# EAGLE schematic Electrical Connections (EAGLE 9.6.2)
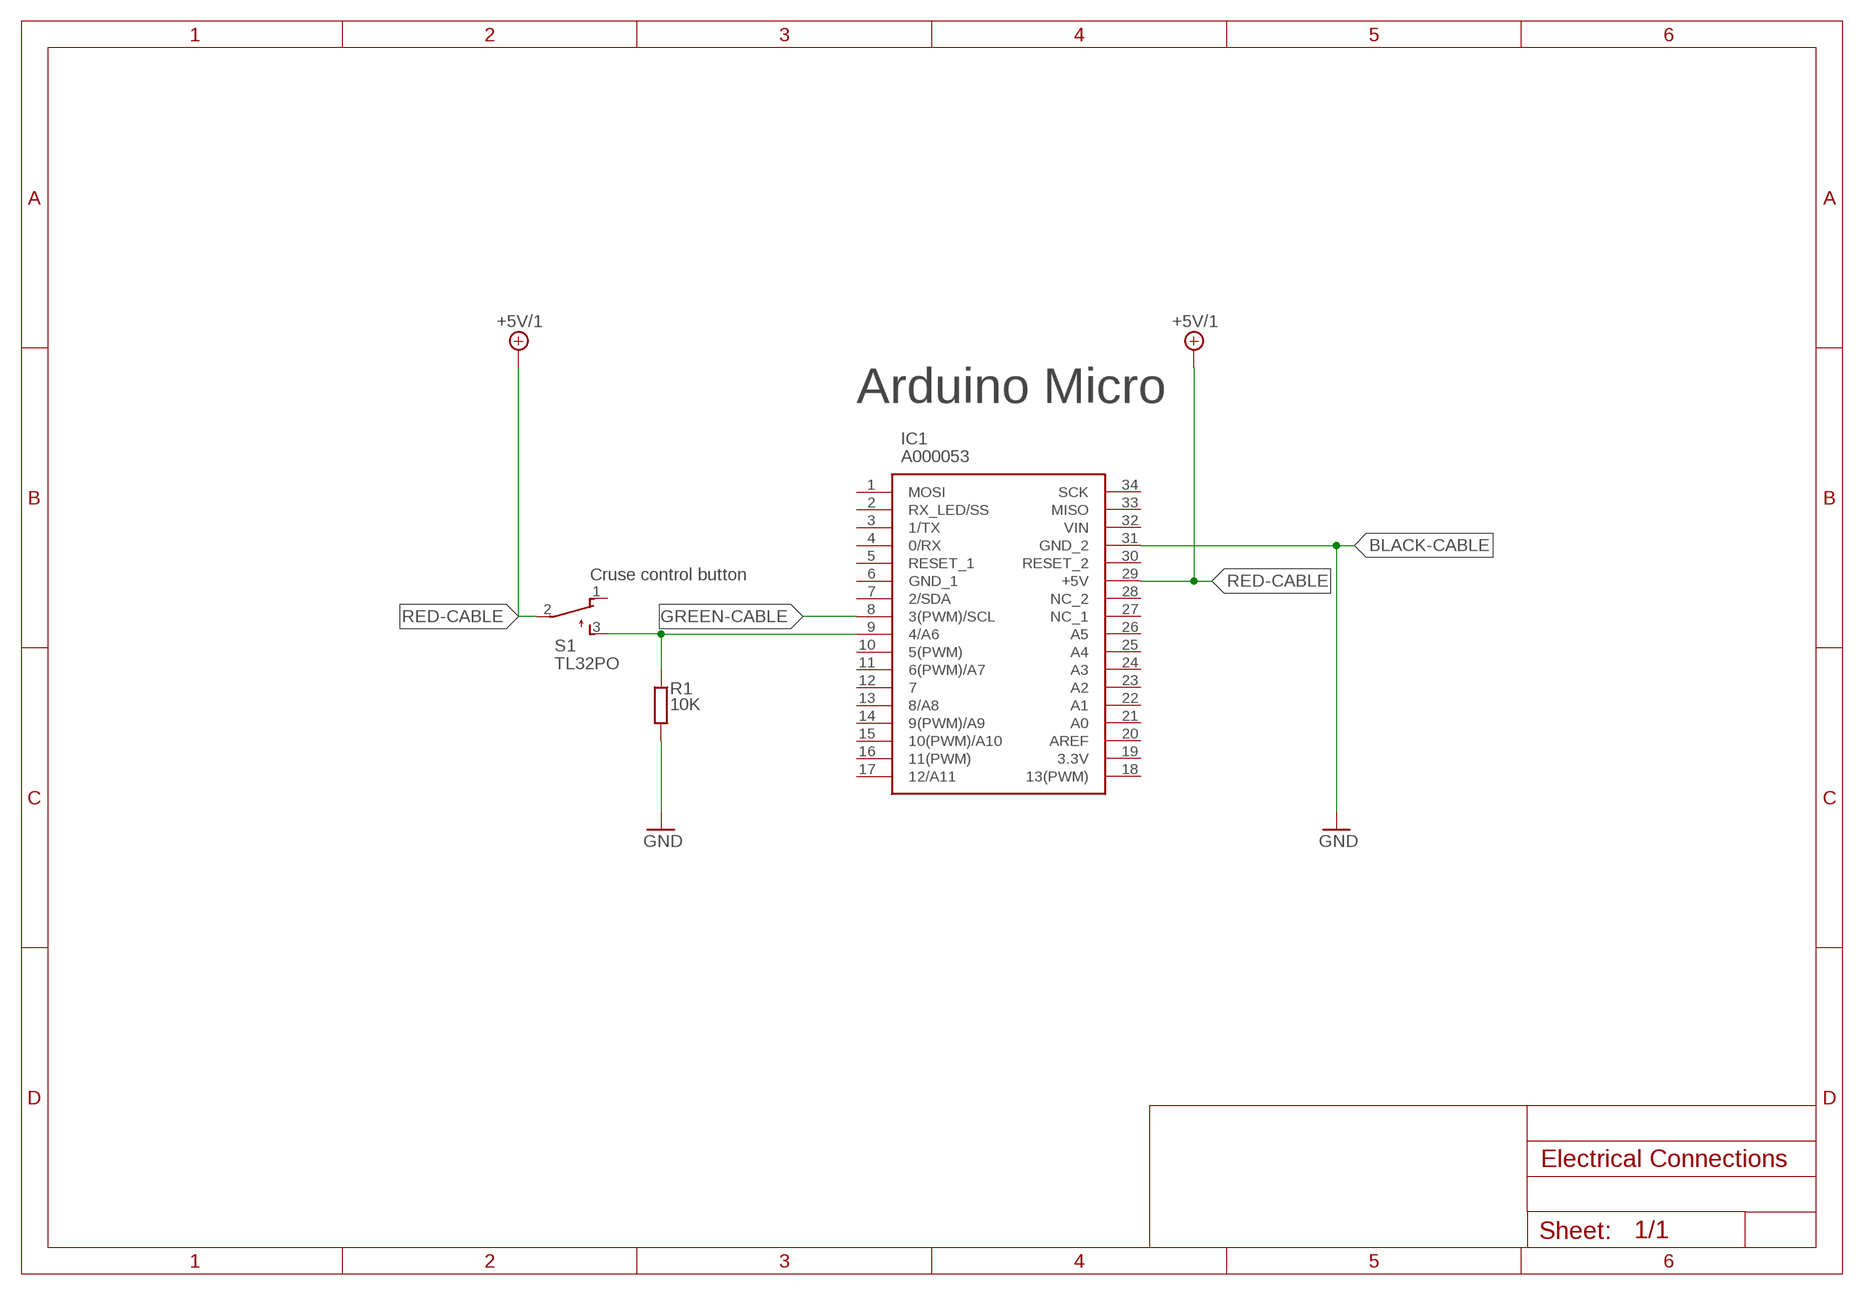
[diagram p0: schematic, sheet 1]

## Parts
IC1  A000053  [HDRV34W70P1570X254_2X17_4900X1]
R1  10K  R-EU_R0603  [R0603]
S1  TL32PO  [TL3XPO]

## Nets
BLACK-CABLE: IC1.31(GND_2) ; supply symbol labelled GND
GND: R1.2
GREEN-CABLE: IC1.8(3(PWM)/SCL)
N$3: IC1.9(4/A6) R1.1 S1.3(S)
RED-CABLE: IC1.29(+5V) S1.2(P) ; supply symbol labelled +5V/1
Unconnected: IC1.1(MOSI) IC1.2(RX_LED/SS) IC1.3(1/TX) IC1.4(0/RX) IC1.5(RESET_1) IC1.7(2/SDA) IC1.10(5(PWM)) IC1.11(6(PWM)/A7) IC1.12 IC1.13(8/A8) IC1.14(9(PWM)/A9) IC1.15(10(PWM)/A10) IC1.16(11(PWM)) IC1.17(12/A11) IC1.18(13(PWM)) IC1.19(3.3V) IC1.20(AREF) IC1.21(A0) IC1.22(A1) IC1.23(A2) IC1.24(A3) IC1.25(A4) IC1.26(A5) IC1.27(NC_1) IC1.28(NC_2) IC1.30(RESET_2) IC1.32(VIN) IC1.33(MISO) IC1.34(SCK) S1.1(O)

## Notes on the sheet
- Arduino Micro
- Cruse control button

## Power pins joined to a net without a drawn wire
GND_1: IC1.6(GND_1)

## Library data of the parts
IC1 = SamacSys_Parts:A000053: Arduino Micro Arduino Micro Source: Datasheet <http://uk.rs-online.com/web/p/products/7717667>; ARROW_PART_NUMBER: A000053; ARROW_PRICE-STOCK: https://www.arrow.com/en/products/a000053/arduino-corporation; DESCRIPTION: Arduino Micro Arduino Micro; HEIGHT: 16mm; MANUFACTURER_NAME: Arduino; MANUFACTURER_PART_NUMBER: A000053; MOUSER_PART_NUMBER: 782-A000053; MOUSER_PRICE-STOCK: https://www.mouser.co.uk/ProductDetail/Arduino/A000053?qs=JYLCs0CWXI3I8GwvoSCg5g%3D%3D
R1 = rcl:R-EU_: RESISTOR, European symbol; SPICEPREFIX: R
S1 = switch:TL32PO: TINY SWITCH ON - MOM Source: http://www2.produktinfo.conrad.com/datenblaetter/700000-724999/705152-da-01-de-Subminiaturschalter_TL_36YO.pdf